# Altium schematic sheet ADC.SchDoc
size A; SheetNumber: 5; SheetTotal: 5
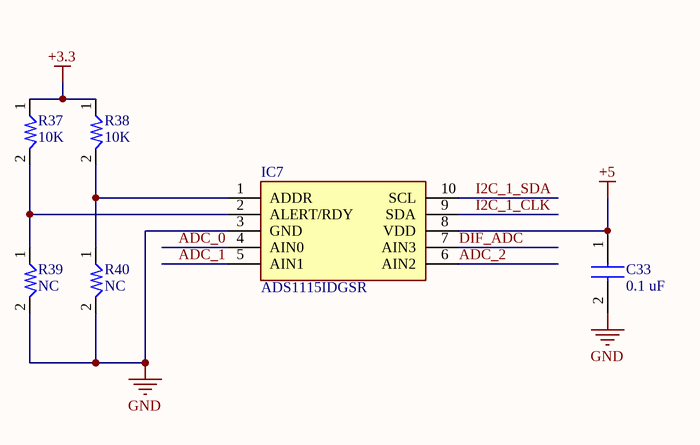
[diagram p0: ADC.SchDoc]

## Parts
C33  0.1 uF  [CAP0603]
IC7  ADS1115IDGSR  [SOP50P490X110-10N]
R37  10K  [RES0603]
R38  10K  [RES0603]
R39  NC  [RES0603]
R40  NC  [RES0603]

## Nets
+3.3: R37.1 R38.1
+5: C33.1 IC7.8(VDD)
GND: C33.2 IC7.3(GND) R39.2 R40.2
ADC_0: IC7.4(AIN0)
ADC_1: IC7.5(AIN1)
ADC_2: IC7.6(AIN2)
DIF_ADC: IC7.7(AIN3)
I2C_1_CLK: IC7.9(SDA)
I2C_1_SDA: IC7.10(SCL)
NetIC7_1: IC7.1(ADDR) R38.2 R40.1
NetIC7_2: IC7.2(ALERT/RDY) R37.2 R39.1

## Library data of the parts
C33 = CC0603KRX7R9BB104: Capacitor; Manufacturer_Name: YAGEO; Datasheet Link: https://componentsearchengine.com/Datasheets/2/CC0603KRX7R9BB104.pdf; Height: 0.9mm; Manufacturer_Part_Number: CC0603KRX7R9BB104; Mouser Part Number: 603-CC603KRX7R9BB104; Mouser Price/Stock: https://www.mouser.co.uk/ProductDetail/YAGEO/CC0603KRX7R9BB104?qs=vTakOoo5QyLvVCYM2ge8LQ%3D%3D; Arrow Part Number: CC0603KRX7R9BB104; Arrow Price/Stock: https://www.arrow.com/en/products/cc0603krx7r9bb104/yageo?utm_currency=USD&region=europe
IC7 = ADS1115IDGSR: Integrated Circuit; Manufacturer_Name: Texas Instruments; Datasheet Link: http://www.ti.com/lit/gpn/ADS1115; Height: 1.1mm; Manufacturer_Part_Number: ADS1115IDGSR; Mouser Part Number: 595-ADS1115IDGSR; Mouser Price/Stock: https://www.mouser.co.uk/ProductDetail/Texas-Instruments/ADS1115IDGSR?qs=IK5e5L0zOXjKCJoVMhYO%2FQ%3D%3D; Arrow Part Number: ADS1115IDGSR; Arrow Price/Stock: https://www.arrow.com/en/products/ads1115idgsr/texas-instruments.html?utm_currency=USD&region=nac
R37-R40 = RES: Resistor; Manufacturer_Name: UNI-ROYAL(Uniroyal Elec); Manufacturer_Part_Number: 0603WAF1001T5E; Datasheet Link: https://datasheet.lcsc.com/szlcsc/Uniroyal-Elec-0603WAF1001T5E_C21190.pdf; Height: 0.55mm